# EAGLE schematic MSP-EXP430FR6989 (EAGLE 6.5.0)

## Sheet 1 of 6
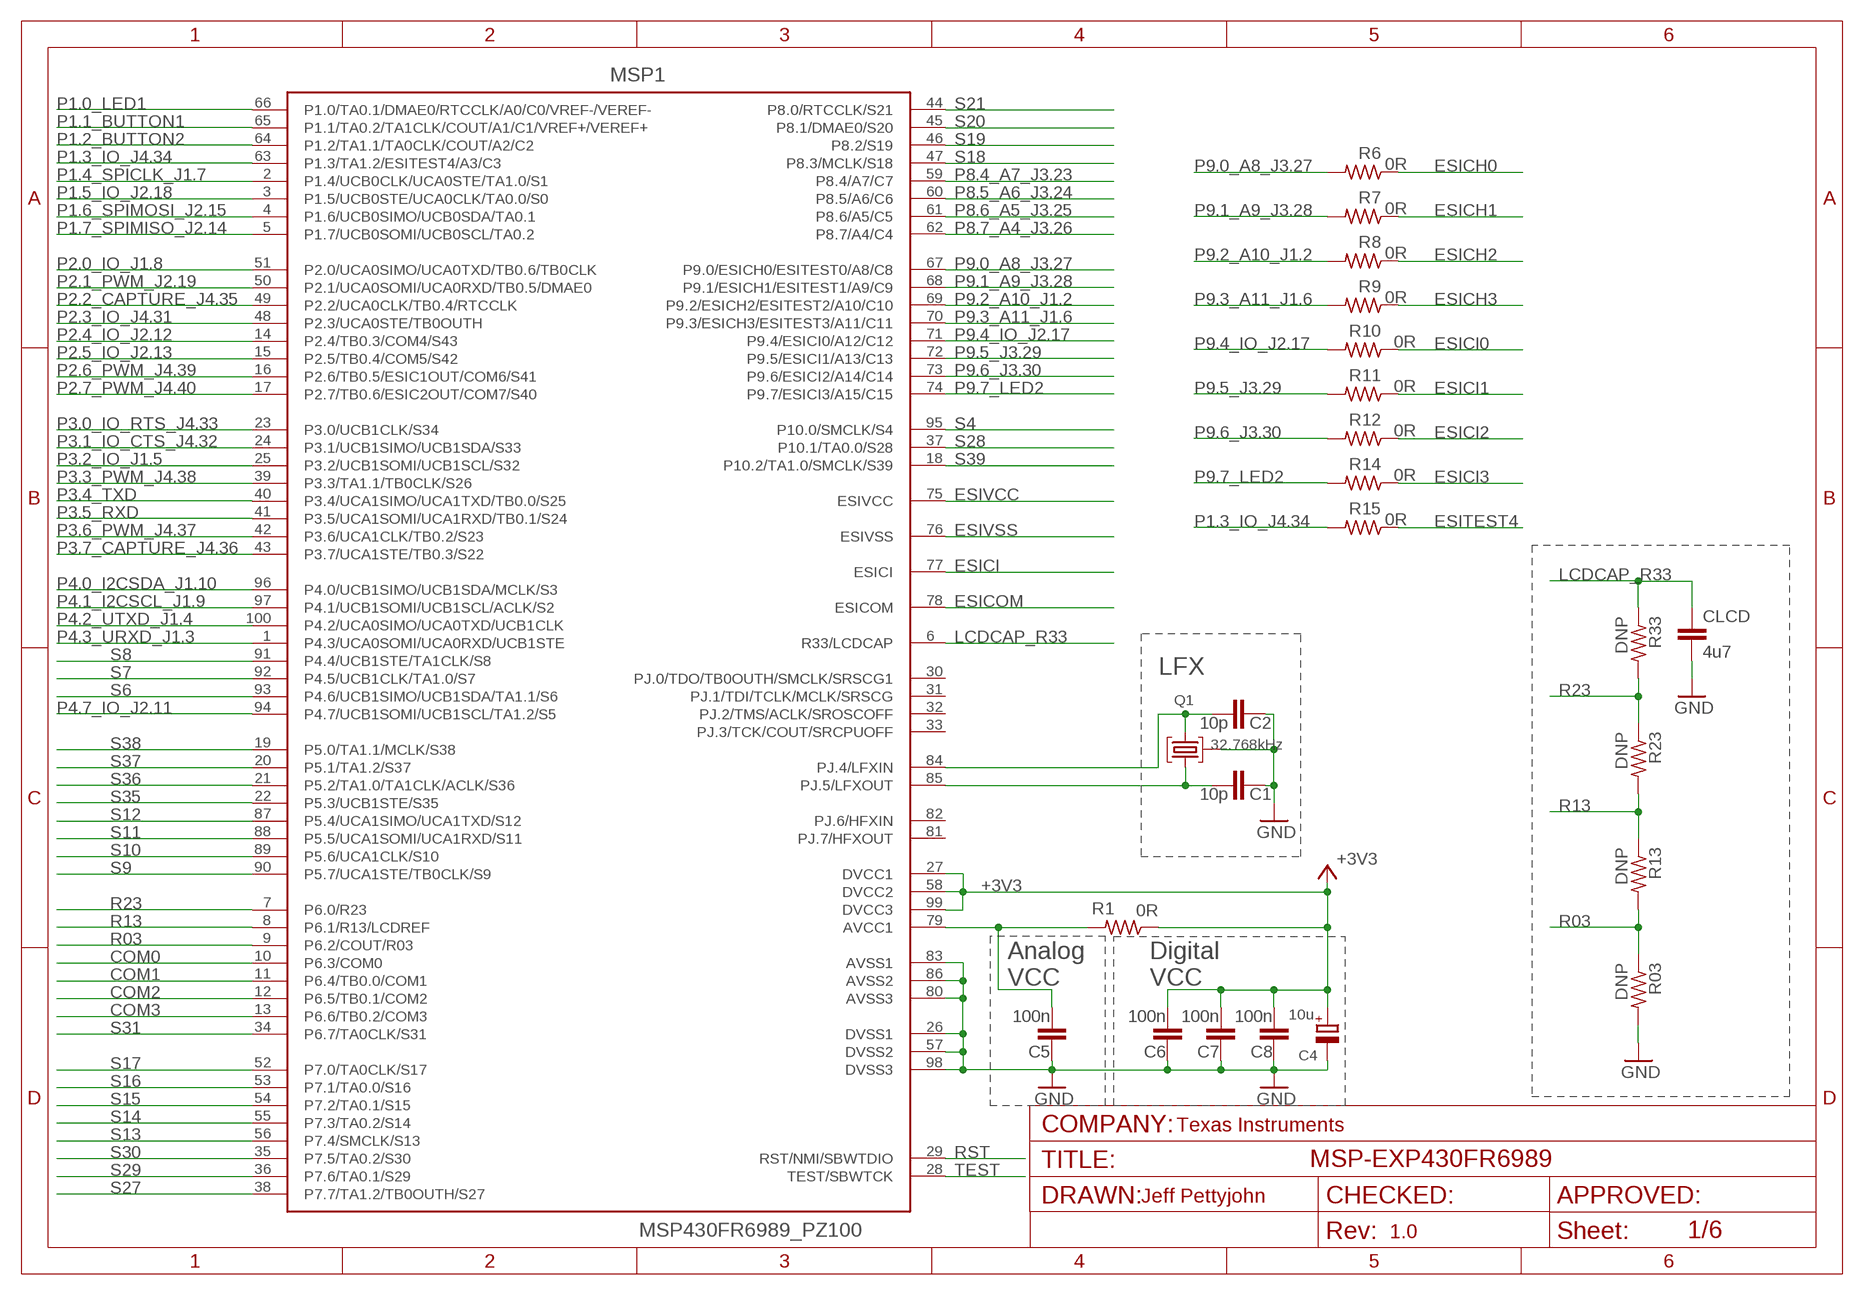
[diagram p0: schematic, sheet 1]

### Parts
C1  10p  C-EUCM0402  [0402]
C2  10p  C-EUCM0402  [0402]
C4  10u  CPOL-EUA/3216-18R  [A/3216-18R]
C5  100n  C-EUCM0402  [0402]
C6  100n  C-EUCM0402  [0402]
C7  100n  C-EUCM0402  [0402]
C8  100n  C-EUCM0402  [0402]
CLCD  4u7  CAPC0603  [0603]
MSP1  MSP430FR6989_PZ100  [PZ100]
Q1  32.768kHz  MS3V-T1R  [MS3V-T1R]
R1  0R  RESR0402  [0402]
R03  DNP  RESR0603  [0603]
R6  0R  RESR0402  [0402]
R7  0R  RESR0402  [0402]
R8  0R  RESR0402  [0402]
R9  0R  RESR0402  [0402]
R10  0R  RESR0402  [0402]
R11  0R  RESR0402  [0402]
R12  0R  RESR0402  [0402]
R13  DNP  RESR0603  [0603]
R14  0R  RESR0402  [0402]
R15  0R  RESR0402  [0402]
R23  DNP  RESR0603  [0603]
R33  DNP  RESR0603  [0603]

### Nets
+3V3: C4.+ C6.1 C7.1 C8.1 MSP1.27(DVCC1) MSP1.58(DVCC2) MSP1.99(DVCC3) R1.1 ; also sheet 2,3,5
COM0: MSP1.10(P6.3/COM0) ; also sheet 2
COM1: MSP1.11(P6.4/TB0.0/COM1) ; also sheet 2
COM2: MSP1.12(P6.5/TB0.1/COM2) ; also sheet 2
COM3: MSP1.13(P6.6/TB0.2/COM3) ; also sheet 2
ESICH0: R6.1 ; also sheet 2
ESICH1: R7.1 ; also sheet 2
ESICH2: R8.1 ; also sheet 2
ESICH3: R9.1 ; also sheet 2
ESICI: MSP1.77(ESICI) ; also sheet 2
ESICI0: R10.1 ; also sheet 2
ESICI1: R11.1 ; also sheet 2
ESICI2: R12.1 ; also sheet 2
ESICI3: R14.1 ; also sheet 2
ESICOM: MSP1.78(ESICOM) ; also sheet 2
ESITEST4: R15.1 ; also sheet 2
ESIVCC: MSP1.75(ESIVCC) ; also sheet 2
ESIVSS: MSP1.76(ESIVSS) ; also sheet 2
GND: C1.2 C2.2 C4.- C5.2 C6.2 C7.2 C8.2 CLCD.2 MSP1.26(DVSS1) MSP1.57(DVSS2) MSP1.80(AVSS3) MSP1.83(AVSS1) MSP1.86(AVSS2) MSP1.98(DVSS3) Q1.P3(GND) R03.2 ; also sheet 2,3,4,5,6
LCDCAP_R33: CLCD.1 MSP1.6(R33/LCDCAP) R33.1
N$3: C5.1 MSP1.79(AVCC1) R1.2
N$14: C1.1 MSP1.85(PJ.5/LFXOUT) Q1.P1
N$17: C2.1 MSP1.84(PJ.4/LFXIN) Q1.P2
P1.0_LED1: MSP1.66(P1.0/TA0.1/DMAE0/RTCCLK/A0/C0/VREF-/VEREF-) ; also sheet 3
P1.1_BUTTON1: MSP1.65(P1.1/TA0.2/TA1CLK/COUT/A1/C1/VREF+/VEREF+) ; also sheet 3
P1.2_BUTTON2: MSP1.64(P1.2/TA1.1/TA0CLK/COUT/A2/C2) ; also sheet 3
P1.3_IO_J4.34: MSP1.63(P1.3/TA1.2/ESITEST4/A3/C3) R15.2 ; also sheet 2
P1.4_SPICLK_J1.7: MSP1.2(P1.4/UCB0CLK/UCA0STE/TA1.0/S1) ; also sheet 2
P1.5_IO_J2.18: MSP1.3(P1.5/UCB0STE/UCA0CLK/TA0.0/S0) ; also sheet 2
P1.6_SPIMOSI_J2.15: MSP1.4(P1.6/UCB0SIMO/UCB0SDA/TA0.1) ; also sheet 2
P1.7_SPIMISO_J2.14: MSP1.5(P1.7/UCB0SOMI/UCB0SCL/TA0.2) ; also sheet 2
P2.0_IO_J1.8: MSP1.51(P2.0/UCA0SIMO/UCA0TXD/TB0.6/TB0CLK) ; also sheet 2
P2.1_PWM_J2.19: MSP1.50(P2.1/UCA0SOMI/UCA0RXD/TB0.5/DMAE0) ; also sheet 2
P2.2_CAPTURE_J4.35: MSP1.49(P2.2/UCA0CLK/TB0.4/RTCCLK) ; also sheet 2
P2.3_IO_J4.31: MSP1.48(P2.3/UCA0STE/TB0OUTH) ; also sheet 2
P2.4_IO_J2.12: MSP1.14(P2.4/TB0.3/COM4/S43) ; also sheet 2
P2.5_IO_J2.13: MSP1.15(P2.5/TB0.4/COM5/S42) ; also sheet 2
P2.6_PWM_J4.39: MSP1.16(P2.6/TB0.5/ESIC1OUT/COM6/S41) ; also sheet 2
P2.7_PWM_J4.40: MSP1.17(P2.7/TB0.6/ESIC2OUT/COM7/S40) ; also sheet 2
P3.0_IO_RTS_J4.33: MSP1.23(P3.0/UCB1CLK/S34) ; also sheet 2,5
P3.1_IO_CTS_J4.32: MSP1.24(P3.1/UCB1SIMO/UCB1SDA/S33) ; also sheet 2,5
P3.2_IO_J1.5: MSP1.25(P3.2/UCB1SOMI/UCB1SCL/S32) ; also sheet 2
P3.3_PWM_J4.38: MSP1.39(P3.3/TA1.1/TB0CLK/S26) ; also sheet 2
P3.4_TXD: MSP1.40(P3.4/UCA1SIMO/UCA1TXD/TB0.0/S25) ; also sheet 5
P3.5_RXD: MSP1.41(P3.5/UCA1SOMI/UCA1RXD/TB0.1/S24) ; also sheet 5
P3.6_PWM_J4.37: MSP1.42(P3.6/UCA1CLK/TB0.2/S23) ; also sheet 2
P3.7_CAPTURE_J4.36: MSP1.43(P3.7/UCA1STE/TB0.3/S22) ; also sheet 2
P4.0_I2CSDA_J1.10: MSP1.96(P4.0/UCB1SIMO/UCB1SDA/MCLK/S3) ; also sheet 2
P4.1_I2CSCL_J1.9: MSP1.97(P4.1/UCB1SOMI/UCB1SCL/ACLK/S2) ; also sheet 2
P4.2_UTXD_J1.4: MSP1.100(P4.2/UCA0SIMO/UCA0TXD/UCB1CLK) ; also sheet 2
P4.3_URXD_J1.3: MSP1.1(P4.3/UCA0SOMI/UCA0RXD/UCB1STE) ; also sheet 2
P4.7_IO_J2.11: MSP1.94(P4.7/UCB1SOMI/UCB1SCL/TA1.2/S5) ; also sheet 2
P8.4_A7_J3.23: MSP1.59(P8.4/A7/C7) ; also sheet 2
P8.5_A6_J3.24: MSP1.60(P8.5/A6/C6) ; also sheet 2
P8.6_A5_J3.25: MSP1.61(P8.6/A5/C5) ; also sheet 2
P8.7_A4_J3.26: MSP1.62(P8.7/A4/C4) ; also sheet 2
P9.0_A8_J3.27: MSP1.67(P9.0/ESICH0/ESITEST0/A8/C8) R6.2 ; also sheet 2
P9.1_A9_J3.28: MSP1.68(P9.1/ESICH1/ESITEST1/A9/C9) R7.2 ; also sheet 2
P9.2_A10_J1.2: MSP1.69(P9.2/ESICH2/ESITEST2/A10/C10) R8.2 ; also sheet 2
P9.3_A11_J1.6: MSP1.70(P9.3/ESICH3/ESITEST3/A11/C11) R9.2 ; also sheet 2
P9.4_IO_J2.17: MSP1.71(P9.4/ESICI0/A12/C12) R10.2 ; also sheet 2
P9.5_J3.29: MSP1.72(P9.5/ESICI1/A13/C13) R11.2 ; also sheet 2
P9.6_J3.30: MSP1.73(P9.6/ESICI2/A14/C14) R12.2 ; also sheet 2
P9.7_LED2: MSP1.74(P9.7/ESICI3/A15/C15) R14.2 ; also sheet 3
R03: MSP1.9(P6.2/COUT/R03) R03.1 R13.2
R13: MSP1.8(P6.1/R13/LCDREF) R13.1 R23.2
R23: MSP1.7(P6.0/R23) R23.1 R33.2
RST: MSP1.29(RST/NMI/SBWTDIO) ; also sheet 2,3,5
S4: MSP1.95(P10.0/SMCLK/S4) ; also sheet 2
S6: MSP1.93(P4.6/UCB1SIMO/UCB1SDA/TA1.1/S6) ; also sheet 2
S7: MSP1.92(P4.5/UCB1CLK/TA1.0/S7) ; also sheet 2
S8: MSP1.91(P4.4/UCB1STE/TA1CLK/S8) ; also sheet 2
S9: MSP1.90(P5.7/UCA1STE/TB0CLK/S9) ; also sheet 2
S10: MSP1.89(P5.6/UCA1CLK/S10) ; also sheet 2
S11: MSP1.88(P5.5/UCA1SOMI/UCA1RXD/S11) ; also sheet 2
S12: MSP1.87(P5.4/UCA1SIMO/UCA1TXD/S12) ; also sheet 2
S13: MSP1.56(P7.4/SMCLK/S13) ; also sheet 2
S14: MSP1.55(P7.3/TA0.2/S14) ; also sheet 2
S15: MSP1.54(P7.2/TA0.1/S15) ; also sheet 2
S16: MSP1.53(P7.1/TA0.0/S16) ; also sheet 2
S17: MSP1.52(P7.0/TA0CLK/S17) ; also sheet 2
S18: MSP1.47(P8.3/MCLK/S18) ; also sheet 2
S19: MSP1.46(P8.2/S19) ; also sheet 2
S20: MSP1.45(P8.1/DMAE0/S20) ; also sheet 2
S21: MSP1.44(P8.0/RTCCLK/S21) ; also sheet 2
S27: MSP1.38(P7.7/TA1.2/TB0OUTH/S27) ; also sheet 2
S28: MSP1.37(P10.1/TA0.0/S28) ; also sheet 2
S29: MSP1.36(P7.6/TA0.1/S29) ; also sheet 2
S30: MSP1.35(P7.5/TA0.2/S30) ; also sheet 2
S31: MSP1.34(P6.7/TA0CLK/S31) ; also sheet 2
S35: MSP1.22(P5.3/UCB1STE/S35) ; also sheet 2
S36: MSP1.21(P5.2/TA1.0/TA1CLK/ACLK/S36) ; also sheet 2
S37: MSP1.20(P5.1/TA1.2/S37) ; also sheet 2
S38: MSP1.19(P5.0/TA1.1/MCLK/S38) ; also sheet 2
S39: MSP1.18(P10.2/TA1.0/SMCLK/S39) ; also sheet 2
TEST: MSP1.28(TEST/SBWTCK) ; also sheet 5
Unconnected: MSP1.30(PJ.0/TDO/TB0OUTH/SMCLK/SRSCG1) MSP1.31(PJ.1/TDI/TCLK/MCLK/SRSCG) MSP1.32(PJ.2/TMS/ACLK/SROSCOFF) MSP1.33(PJ.3/TCK/COUT/SRCPUOFF) MSP1.81(PJ.7/HFXOUT) MSP1.82(PJ.6/HFXIN)

### Notes on the sheet
- LFX
- Analog | Digital
- VCC | VCC
- Texas Instruments
- Jeff Pettyjohn
- 1.0

## Sheet 2 of 6
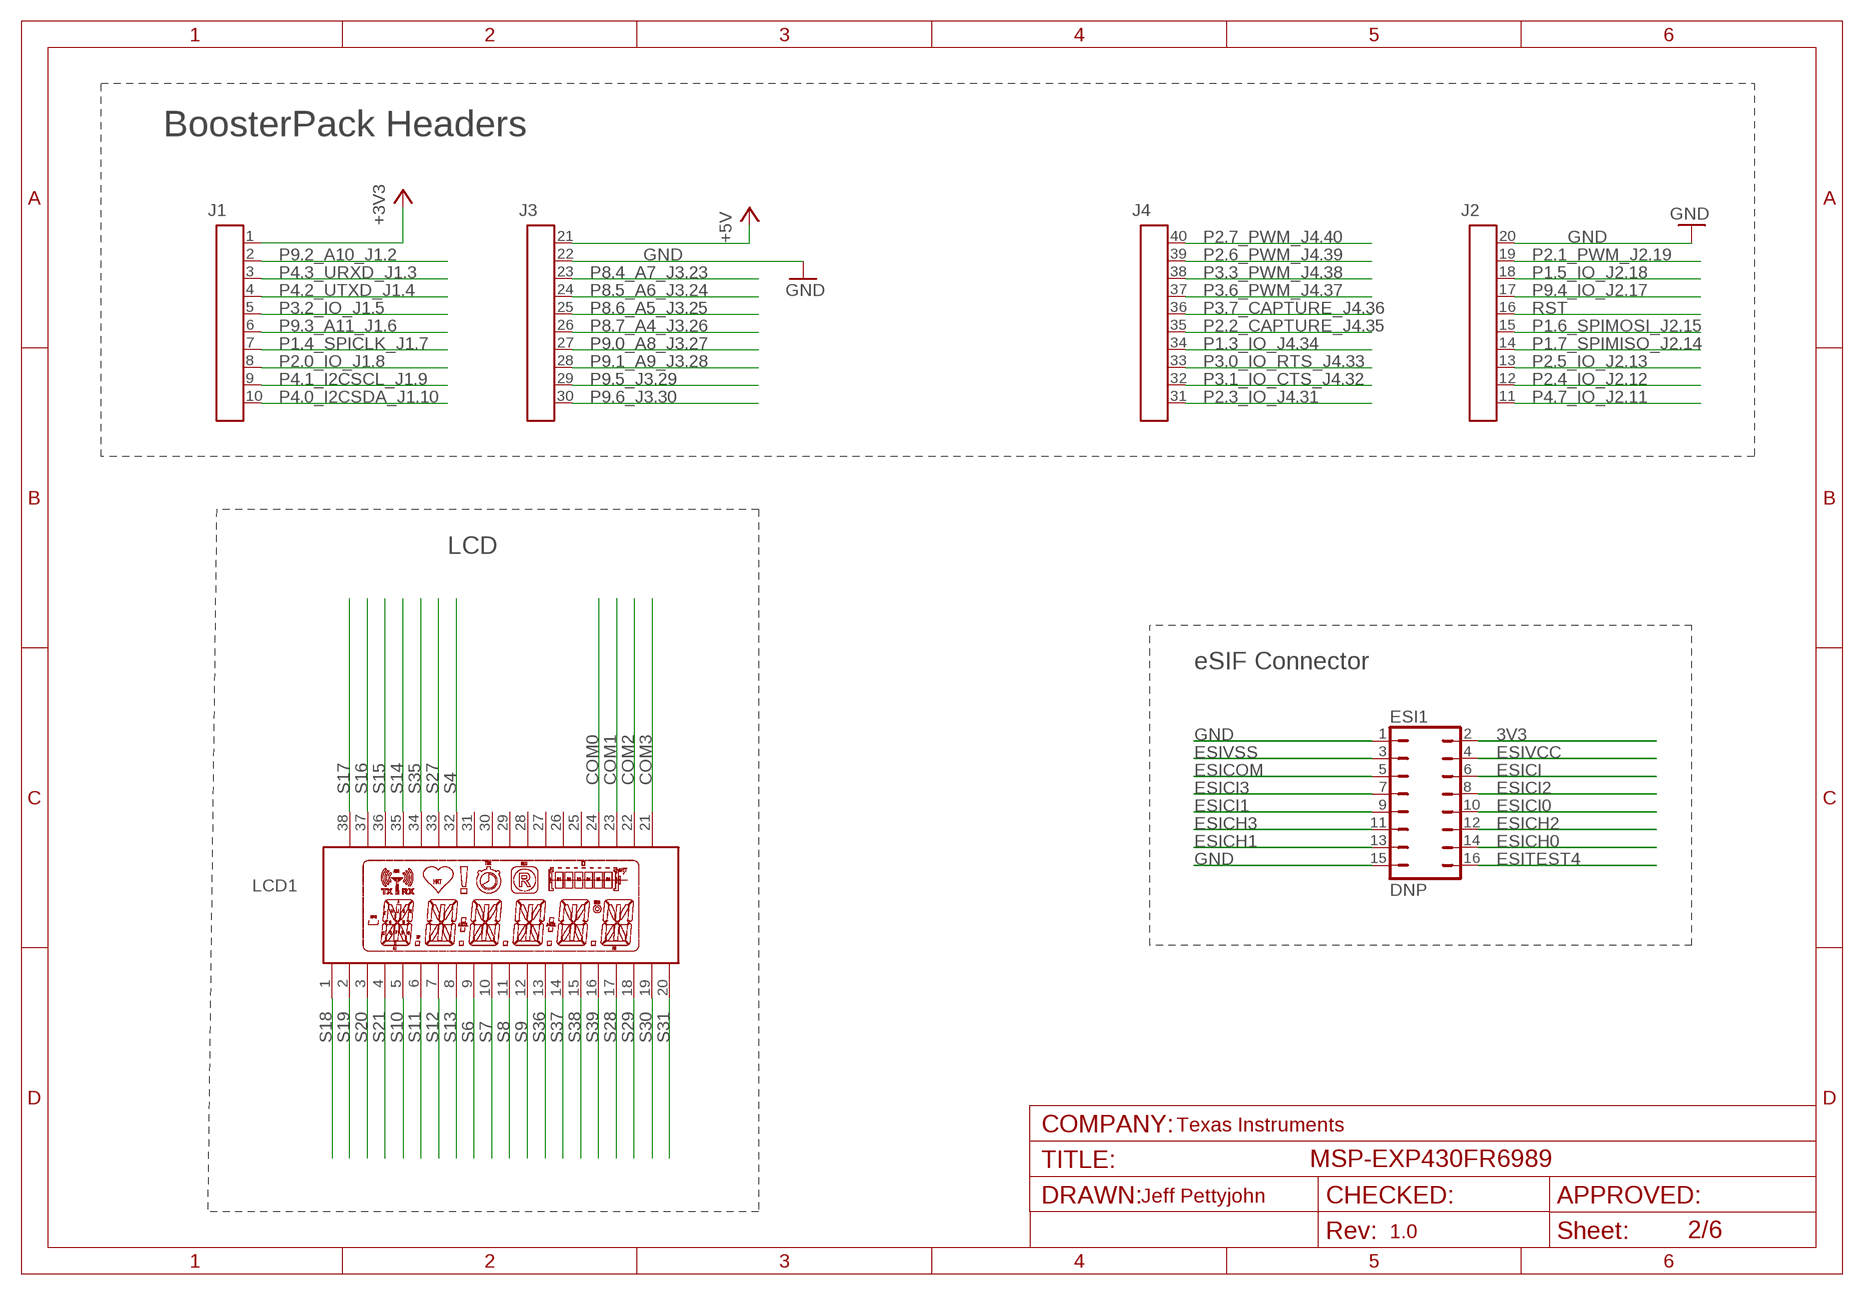
[diagram p1: schematic, sheet 2]

### Parts
ESI1  DNP  JP8Q  [JP8Q]
J1  HEADER1X10  [1X10]
J2  HEADER1X10-J2  [1X10-J2]
J3  HEADER1X10-J3  [1X10-J3]
J4  HEADER1X10-J4  [1X10-J4]
LCD1  FH1138P  [FH1138P]

### Nets
3V3: ESI1.2
+3V3: J1.1 ; also sheet 1,3,5
+5V [Power]: J3.21 ; also sheet 3,5
COM0: LCD1.24 ; also sheet 1
COM1: LCD1.23 ; also sheet 1
COM2: LCD1.22 ; also sheet 1
COM3: LCD1.21 ; also sheet 1
ESICH0: ESI1.14 ; also sheet 1
ESICH1: ESI1.13 ; also sheet 1
ESICH2: ESI1.12 ; also sheet 1
ESICH3: ESI1.11 ; also sheet 1
ESICI: ESI1.6 ; also sheet 1
ESICI0: ESI1.10 ; also sheet 1
ESICI1: ESI1.9 ; also sheet 1
ESICI2: ESI1.8 ; also sheet 1
ESICI3: ESI1.7 ; also sheet 1
ESICOM: ESI1.5 ; also sheet 1
ESITEST4: ESI1.16 ; also sheet 1
ESIVCC: ESI1.4 ; also sheet 1
ESIVSS: ESI1.3 ; also sheet 1
GND: ESI1.1 ESI1.15 J2.20 J3.22 ; also sheet 1,3,4,5,6
P1.3_IO_J4.34: J4.34 ; also sheet 1
P1.4_SPICLK_J1.7: J1.7 ; also sheet 1
P1.5_IO_J2.18: J2.18 ; also sheet 1
P1.6_SPIMOSI_J2.15: J2.15 ; also sheet 1
P1.7_SPIMISO_J2.14: J2.14 ; also sheet 1
P2.0_IO_J1.8: J1.8 ; also sheet 1
P2.1_PWM_J2.19: J2.19 ; also sheet 1
P2.2_CAPTURE_J4.35: J4.35 ; also sheet 1
P2.3_IO_J4.31: J4.31 ; also sheet 1
P2.4_IO_J2.12: J2.12 ; also sheet 1
P2.5_IO_J2.13: J2.13 ; also sheet 1
P2.6_PWM_J4.39: J4.39 ; also sheet 1
P2.7_PWM_J4.40: J4.40 ; also sheet 1
P3.0_IO_RTS_J4.33: J4.33 ; also sheet 1,5
P3.1_IO_CTS_J4.32: J4.32 ; also sheet 1,5
P3.2_IO_J1.5: J1.5 ; also sheet 1
P3.3_PWM_J4.38: J4.38 ; also sheet 1
P3.6_PWM_J4.37: J4.37 ; also sheet 1
P3.7_CAPTURE_J4.36: J4.36 ; also sheet 1
P4.0_I2CSDA_J1.10: J1.10 ; also sheet 1
P4.1_I2CSCL_J1.9: J1.9 ; also sheet 1
P4.2_UTXD_J1.4: J1.4 ; also sheet 1
P4.3_URXD_J1.3: J1.3 ; also sheet 1
P4.7_IO_J2.11: J2.11 ; also sheet 1
P8.4_A7_J3.23: J3.23 ; also sheet 1
P8.5_A6_J3.24: J3.24 ; also sheet 1
P8.6_A5_J3.25: J3.25 ; also sheet 1
P8.7_A4_J3.26: J3.26 ; also sheet 1
P9.0_A8_J3.27: J3.27 ; also sheet 1
P9.1_A9_J3.28: J3.28 ; also sheet 1
P9.2_A10_J1.2: J1.2 ; also sheet 1
P9.3_A11_J1.6: J1.6 ; also sheet 1
P9.4_IO_J2.17: J2.17 ; also sheet 1
P9.5_J3.29: J3.29 ; also sheet 1
P9.6_J3.30: J3.30 ; also sheet 1
RST: J2.16 ; also sheet 1,3,5
S4: LCD1.32 ; also sheet 1
S6: LCD1.9 ; also sheet 1
S7: LCD1.10 ; also sheet 1
S8: LCD1.11 ; also sheet 1
S9: LCD1.12 ; also sheet 1
S10: LCD1.5 ; also sheet 1
S11: LCD1.6 ; also sheet 1
S12: LCD1.7 ; also sheet 1
S13: LCD1.8 ; also sheet 1
S14: LCD1.35 ; also sheet 1
S15: LCD1.36 ; also sheet 1
S16: LCD1.37 ; also sheet 1
S17: LCD1.38 ; also sheet 1
S18: LCD1.1 ; also sheet 1
S19: LCD1.2 ; also sheet 1
S20: LCD1.3 ; also sheet 1
S21: LCD1.4 ; also sheet 1
S27: LCD1.33 ; also sheet 1
S28: LCD1.17 ; also sheet 1
S29: LCD1.18 ; also sheet 1
S30: LCD1.19 ; also sheet 1
S31: LCD1.20 ; also sheet 1
S35: LCD1.34 ; also sheet 1
S36: LCD1.13 ; also sheet 1
S37: LCD1.14 ; also sheet 1
S38: LCD1.15 ; also sheet 1
S39: LCD1.16 ; also sheet 1
Unconnected: LCD1.25 LCD1.26 LCD1.27 LCD1.28 LCD1.29 LCD1.30 LCD1.31

### Notes on the sheet
- BoosterPack Headers
- LCD
- eSIF Connector
- Texas Instruments
- Jeff Pettyjohn
- 1.0

## Sheet 3 of 6
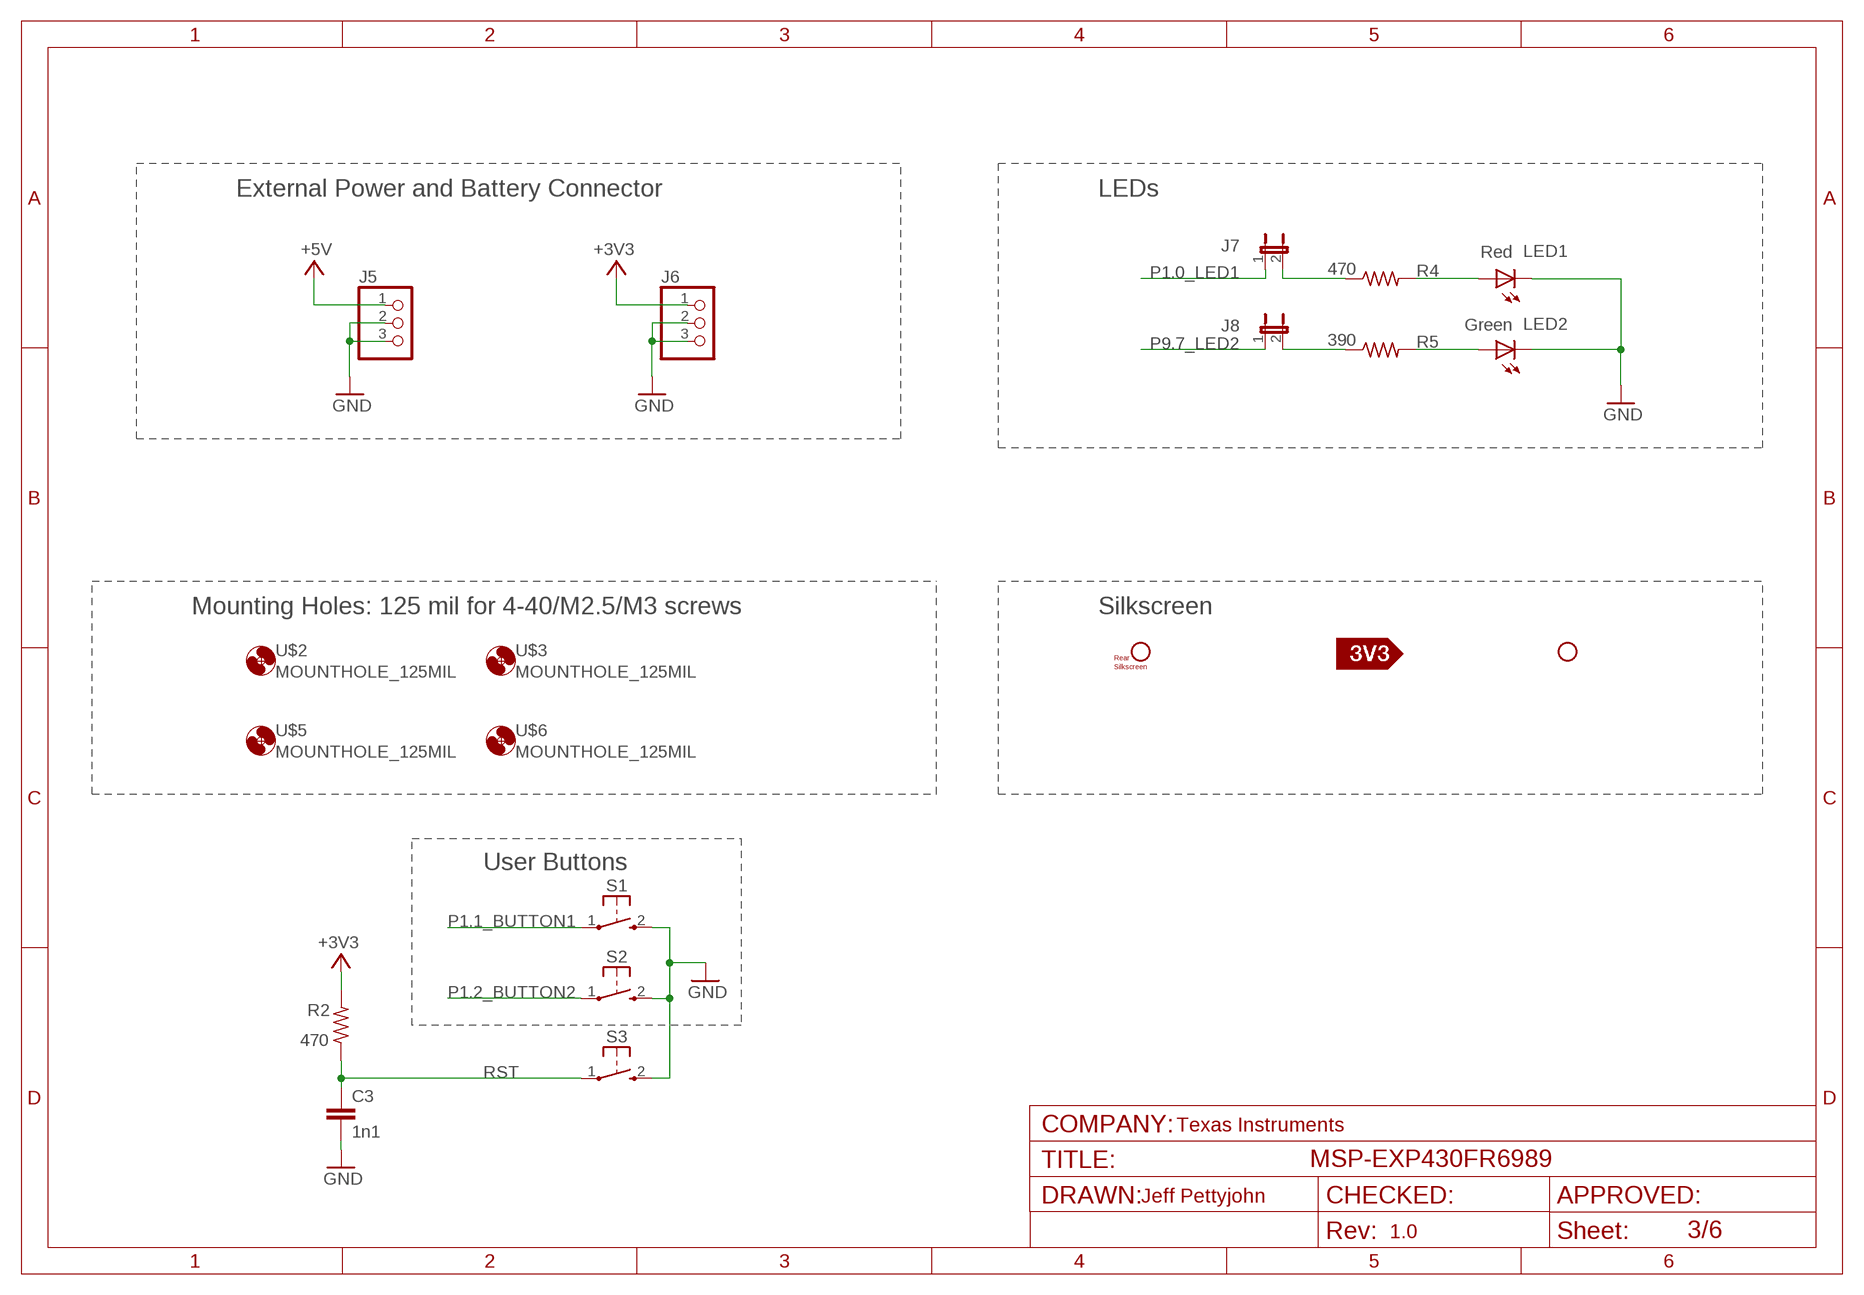
[diagram p2: schematic, sheet 3]

### Parts
C3  1n1  C-EUCM0402  [0402]
J5  PINHEADER1X3  [PINHEADER1X3]
J6  PINHEADER1X3  [PINHEADER1X3]
J7  JUMPER_2.51MM  [JUMPER-2.54]
J8  JUMPER_2.51MM  [JUMPER-2.54]
LED1  Red  CHIP-LED  [LED0805]
LED2  Green  CHIP-LED  [LED0805]
R2  470  RESR0402  [0402]
R4  470  RESR0402  [0402]
R5  390  RESR0402  [0402]
S1  PB  [PBTH]
S2  PB  [PBTH]
S3  PB  [PBTH]
U$1  FR6989_REARSILK_REV0_1  [FR6989_REARSILK_REV0_1]
U$2  MOUNTHOLE_125MIL  [MOUNTHOLE_125MIL]
U$3  MOUNTHOLE_125MIL  [MOUNTHOLE_125MIL]
U$5  MOUNTHOLE_125MIL  [MOUNTHOLE_125MIL]
U$6  MOUNTHOLE_125MIL  [MOUNTHOLE_125MIL]
U$7  SILK_3V3_TAG  [SILK_3V3_TAG]
U$8  ESIF  [ESIF]

### Nets
+3V3: J6.1 R2.2 ; also sheet 1,2,5
+5V [Power]: J5.1 ; also sheet 2,5
GND: C3.2 J5.2 J5.3 J6.2 J6.3 LED1.C LED2.C S1.2(S) S2.2(S) S3.2(S) ; also sheet 1,2,4,5,6
N$4: J8.2 R5.1
N$6: J7.2 R4.1
N$7: LED1.A R4.2
N$8: LED2.A R5.2
P1.0_LED1: J7.1 ; also sheet 1
P1.1_BUTTON1: S1.1(P) ; also sheet 1
P1.2_BUTTON2: S2.1(P) ; also sheet 1
P9.7_LED2: J8.1 ; also sheet 1
RST: C3.1 R2.1 S3.1(P) ; also sheet 1,2,5

### Notes on the sheet
- External Power and Battery Connector | LEDs
- Mounting Holes: 125 mil for 4-40/M2.5/M3 screws | Silkscreen
- User Buttons
- Texas Instruments
- Jeff Pettyjohn
- 1.0

## Sheet 4 of 6
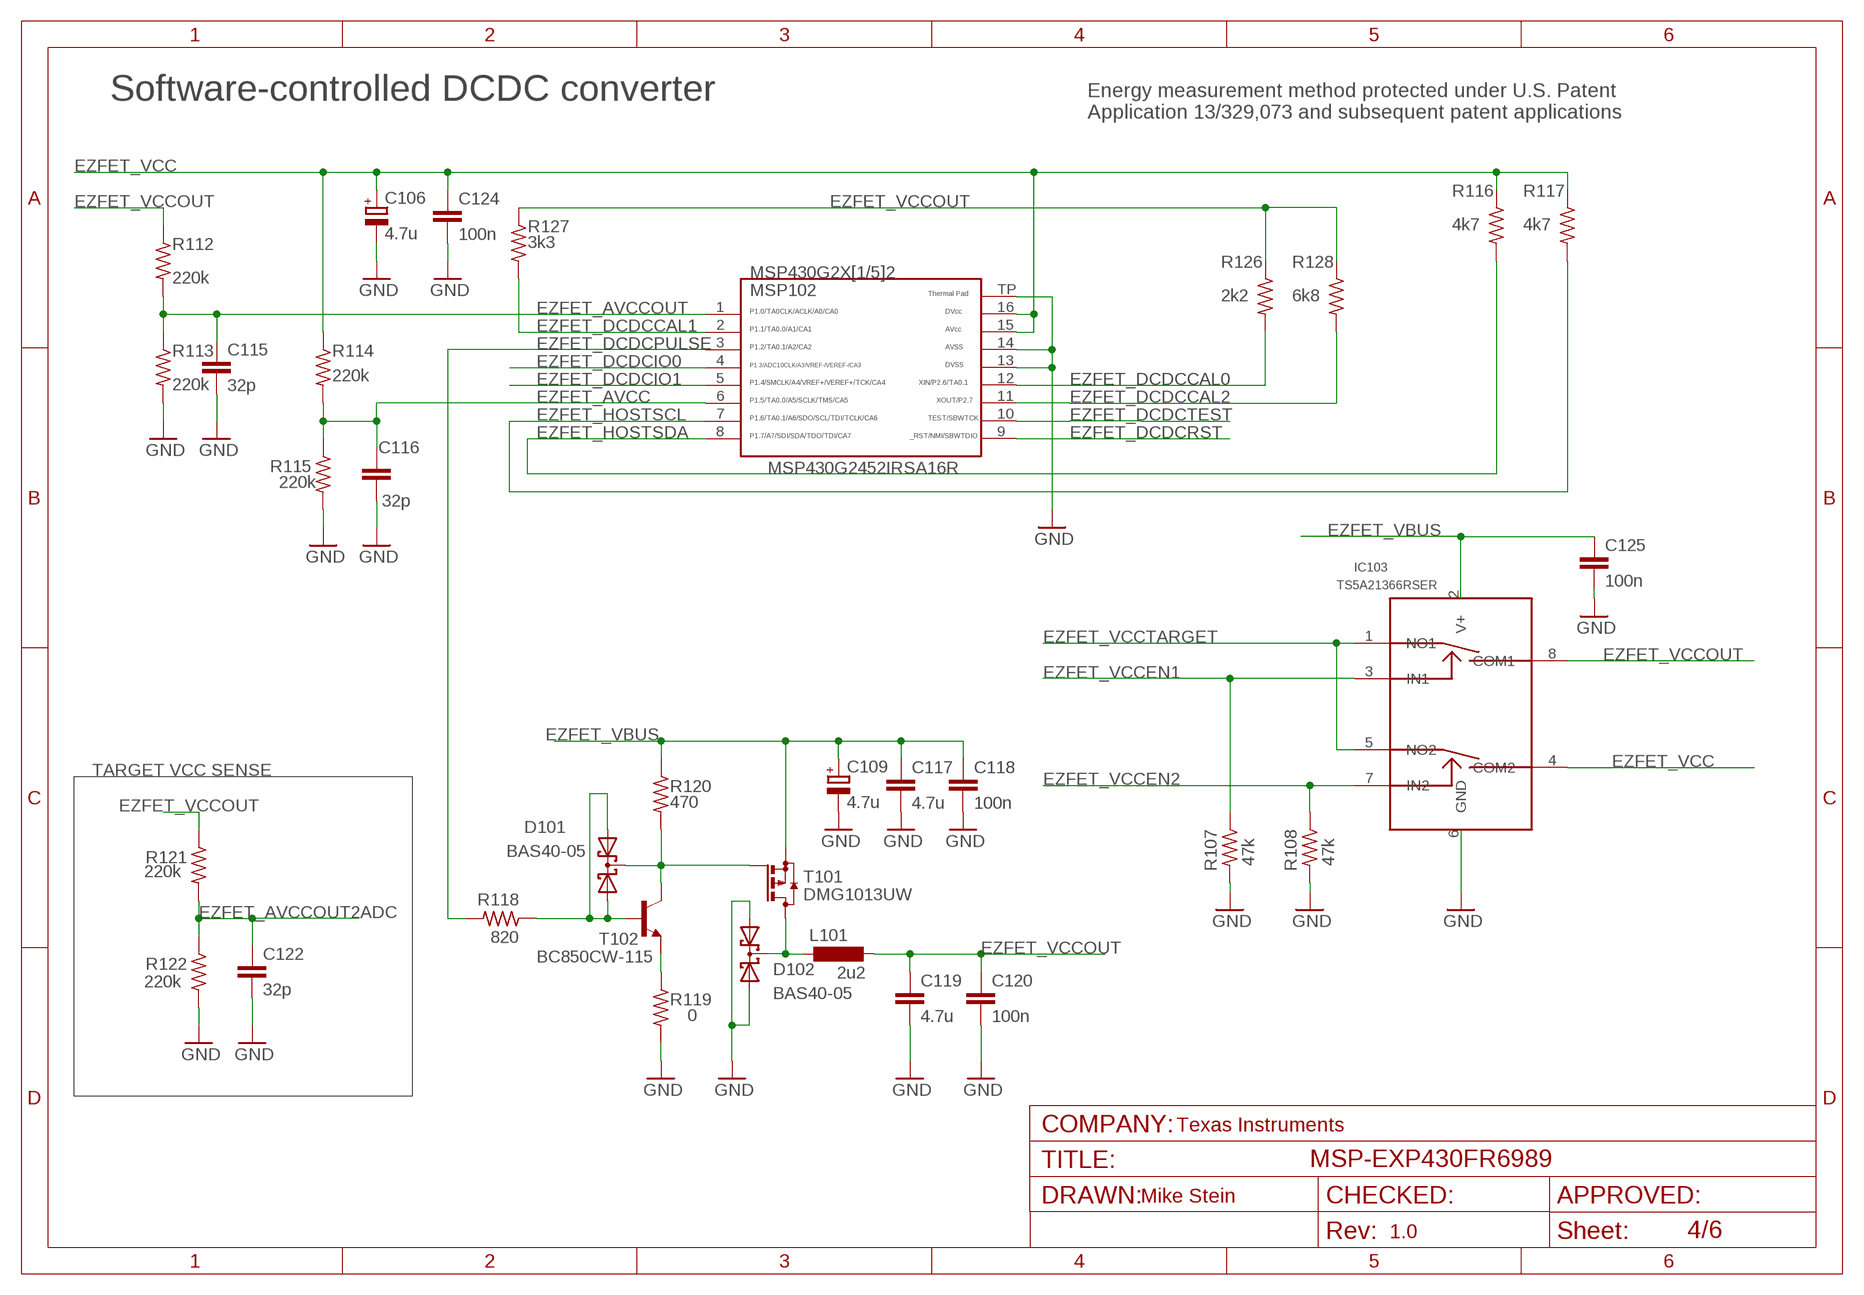
[diagram p3: schematic, sheet 4]

### Parts
C106  4.7u  CPOL-EUA/3216-18R  [A/3216-18R]
C109  4.7u  CPOL-EUA/3216-18R  [A/3216-18R]
C115  32p  C-EUCM0402  [0402]
C116  32p  C-EUCM0402  [0402]
C117  4.7u  C-EUC0603  [C0603]
C118  100n  C-EUCM0402  [0402]
C119  4.7u  C-EUC0603  [C0603]
C120  100n  C-EUCM0402  [0402]
C122  32p  C-EUCM0402  [0402]
C124  100n  C-EUCM0402  [0402]
C125  100n  C-EUCM0402  [0402]
D101  BAS40-05  BAS40-05W  [SOT323]
D102  BAS40-05  BAS40-05W  [SOT323]
IC103  TS5A21366RSER  [UQFN_RSE]
L101  2u2  L-EUL3216C  [L3216C]
MSP102  MSP430G2452IRSA16R  G2X[1/5]2---RSA16  [RSA16]
R107  47k  RESR0402  [0402]
R108  47k  RESR0402  [0402]
R112  220k  RESR0402  [0402]
R113  220k  RESR0402  [0402]
R114  220k  RESR0402  [0402]
R115  220k  RESR0402  [0402]
R116  4k7  RESR0402  [0402]
R117  4k7  RESR0402  [0402]
R118  820  RESR0402  [0402]
R119  0  RESR0402  [0402]
R120  470  RESR0402  [0402]
R121  220k  RESR0402  [0402]
R122  220k  RESR0402  [0402]
R126  2k2  RESR0402  [0402]
R127  3k3  RESR0402  [0402]
R128  6k8  RESR0402  [0402]
T101  DMG1013UW  [SOT323]
T102  BC850CW-115  [SOT323]

### Nets
EZFET_AVCC: C116.2 MSP102.6 R114.2 R115.1
EZFET_AVCCOUT: C115.2 MSP102.1 R112.2 R113.1
EZFET_AVCCOUT2ADC: C122.2 R121.2 R122.1 ; also sheet 5
EZFET_DCDCCAL0: MSP102.12 R126.2
EZFET_DCDCCAL1: MSP102.2 R127.2
EZFET_DCDCCAL2: MSP102.11 R128.2
EZFET_DCDCIO0: MSP102.4 ; also sheet 5
EZFET_DCDCIO1: MSP102.5 ; also sheet 5
EZFET_DCDCPULSE: MSP102.3 R118.2 ; also sheet 5
EZFET_DCDCRST: MSP102.9 ; also sheet 5,6
EZFET_DCDCTEST: MSP102.10 ; also sheet 5,6
EZFET_HOSTSCL: MSP102.7 R117.2 ; also sheet 5
EZFET_HOSTSDA: MSP102.8 R116.2 ; also sheet 5
EZFET_VBUS: C109.+ C117.1 C118.1 C125.1 IC103.2(V+) R120.1 T101.2(S) ; also sheet 5,6
EZFET_VCC: C106.+ C124.1 IC103.4(COM2) MSP102.15 MSP102.16 R114.1 R116.1 R117.1 ; also sheet 5,6
EZFET_VCCEN1: IC103.3(IN1) R107.1 ; also sheet 5
EZFET_VCCEN2: IC103.7(IN2) R108.1 ; also sheet 5
EZFET_VCCOUT: C119.1 C120.1 IC103.8(COM1) L101.2 R112.1 R121.1 R126.1 R127.1 R128.1
EZFET_VCCTARGET: IC103.1(NO1) IC103.5(NO2) ; also sheet 5
GND: C106.- C109.- C115.1 C116.1 C117.2 C118.2 C119.2 C120.2 C122.1 C124.2 C125.2 D102.1(A1) D102.2(A2) IC103.6(GND) MSP102.13 MSP102.14 MSP102.TP R107.2 R108.2 R113.2 R115.2 R119.2 R122.2 ; also sheet 1,2,3,5,6
N$12: R119.1 T102.2(E)
N$13: D101.1(A1) D101.2(A2) R118.1 T102.1(B)
N$15: D102.3(C) L101.1 T101.3(D)
N$16: D101.3(C) R120.2 T101.1(G) T102.3(C)

### Notes on the sheet
- Software-controlled DCDC converter
- Energy measurement method protected under U.S. Patent 
  Application 13/329,073 and subsequent patent applications
- MSP430G2452IRSA16R
- TARGET VCC SENSE
- Texas Instruments
- Mike Stein
- 1.0

## Sheet 5 of 6
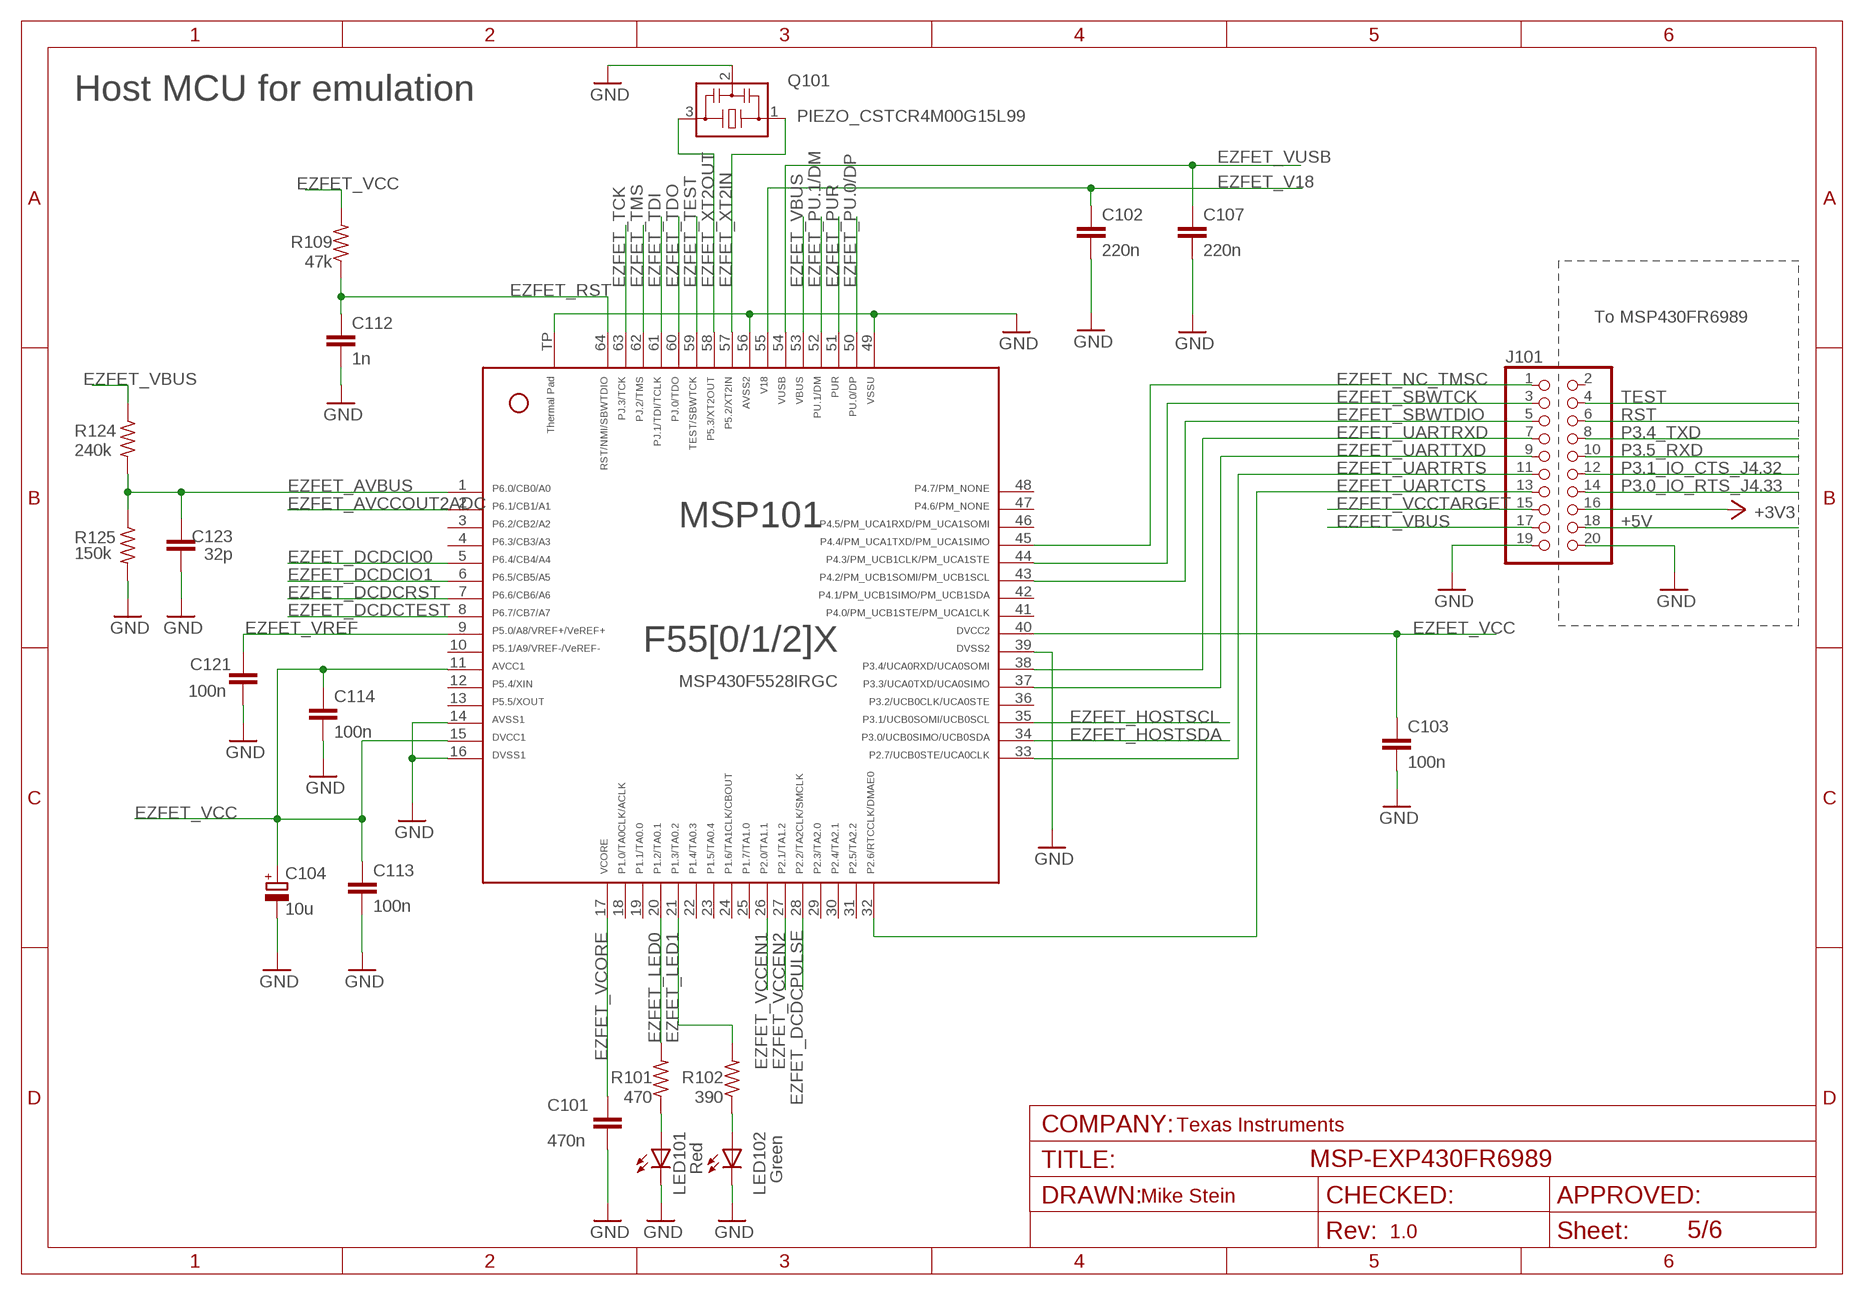
[diagram p4: schematic, sheet 5]

### Parts
C101  470n  C-EUCM0402  [0402]
C102  220n  C-EUCM0402  [0402]
C103  100n  C-EUCM0402  [0402]
C104  10u  CPOL-EUA/3216-18R  [A/3216-18R]
C107  220n  C-EUCM0402  [0402]
C112  1n  C-EUCM0402  [0402]
C113  100n  C-EUCM0402  [0402]
C114  100n  C-EUCM0402  [0402]
C121  100n  C-EUCM0402  [0402]
C123  32p  C-EUCM0402  [0402]
J101  PINHD-2X10  [2X10]
LED101  Red  CHIP-LED  [LED0805]
LED102  Green  CHIP-LED  [LED0805]
MSP101  MSP430F5528IRGC  F55[0/1/2]X---RGC64  [RGC64]
Q101  PIEZO_CSTCR4M00G15L99  CSTCR4M  [CSTCR4M]
R101  470  RESR0402  [0402]
R102  390  RESR0402  [0402]
R109  47k  RESR0402  [0402]
R124  240k  RESR0402  [0402]
R125  150k  RESR0402  [0402]

### Nets
+3V3: J101.16 ; also sheet 1,2,3
+5V [Power]: J101.18 ; also sheet 2,3
EZFET_AVBUS: C123.2 MSP101.1 R124.2 R125.1
EZFET_AVCCOUT2ADC: MSP101.2 ; also sheet 4
EZFET_DCDCIO0: MSP101.5 ; also sheet 4
EZFET_DCDCIO1: MSP101.6 ; also sheet 4
EZFET_DCDCPULSE: MSP101.28 ; also sheet 4
EZFET_DCDCRST: MSP101.7 ; also sheet 4,6
EZFET_DCDCTEST: MSP101.8 ; also sheet 4,6
EZFET_HOSTSCL: MSP101.35 ; also sheet 4
EZFET_HOSTSDA: MSP101.34 ; also sheet 4
EZFET_LED0: MSP101.20 R101.2
EZFET_LED1: MSP101.21 R102.2
EZFET_NC_TMSC: J101.1 MSP101.45
EZFET_PU.0/DP: MSP101.50 ; also sheet 6
EZFET_PU.1/DM: MSP101.52 ; also sheet 6
EZFET_PUR: MSP101.51 ; also sheet 6
EZFET_RST: C112.1 MSP101.64 R109.1 ; also sheet 6
EZFET_SBWTCK: J101.3 MSP101.44
EZFET_SBWTDIO: J101.5 MSP101.43
EZFET_TCK: MSP101.63 ; also sheet 6
EZFET_TDI: MSP101.61 ; also sheet 6
EZFET_TDO: MSP101.60 ; also sheet 6
EZFET_TEST: MSP101.59 ; also sheet 6
EZFET_TMS: MSP101.62 ; also sheet 6
EZFET_UARTCTS: J101.13 MSP101.32
EZFET_UARTRTS: J101.11 MSP101.33
EZFET_UARTRXD: J101.7 MSP101.38
EZFET_UARTTXD: J101.9 MSP101.37
EZFET_V18: C102.1 MSP101.55
EZFET_VBUS: J101.17 MSP101.53 R124.1 ; also sheet 4,6
EZFET_VCC: C103.1 C104.+ C113.1 C114.1 MSP101.11 MSP101.15 MSP101.40 R109.2 ; also sheet 4,6
EZFET_VCCEN1: MSP101.26 ; also sheet 4
EZFET_VCCEN2: MSP101.27 ; also sheet 4
EZFET_VCCTARGET: J101.15 ; also sheet 4
EZFET_VCORE: C101.1 MSP101.17
EZFET_VREF: C121.1 MSP101.9
EZFET_VUSB: C107.1 MSP101.54
EZFET_XT2IN: MSP101.57 Q101.1
EZFET_XT2OUT: MSP101.58 Q101.3
GND: C101.2 C102.2 C103.2 C104.- C107.2 C112.2 C113.2 C114.2 C121.2 C123.1 J101.19 J101.20 LED101.C LED102.C MSP101.14 MSP101.16 MSP101.39 MSP101.49 MSP101.56 MSP101.TP Q101.2 R125.2 ; also sheet 1,2,3,4,6
N$1: LED101.A R101.1
N$2: LED102.A R102.1
P3.0_IO_RTS_J4.33: J101.14 ; also sheet 1,2
P3.1_IO_CTS_J4.32: J101.12 ; also sheet 1,2
P3.4_TXD: J101.8 ; also sheet 1
P3.5_RXD: J101.10 ; also sheet 1
RST: J101.6 ; also sheet 1,2,3
TEST: J101.4 ; also sheet 1
Unconnected: J101.2 MSP101.3 MSP101.4 MSP101.10 MSP101.12 MSP101.13 MSP101.18 MSP101.19 MSP101.22 MSP101.23 MSP101.24 MSP101.25 MSP101.29 MSP101.30 MSP101.31 MSP101.36 MSP101.41 MSP101.42 MSP101.46 MSP101.47 MSP101.48

### Notes on the sheet
- Host MCU for emulation
- To MSP430FR6989
- MSP430F5528IRGC
- Texas Instruments
- Mike Stein
- 1.0

## Sheet 6 of 6
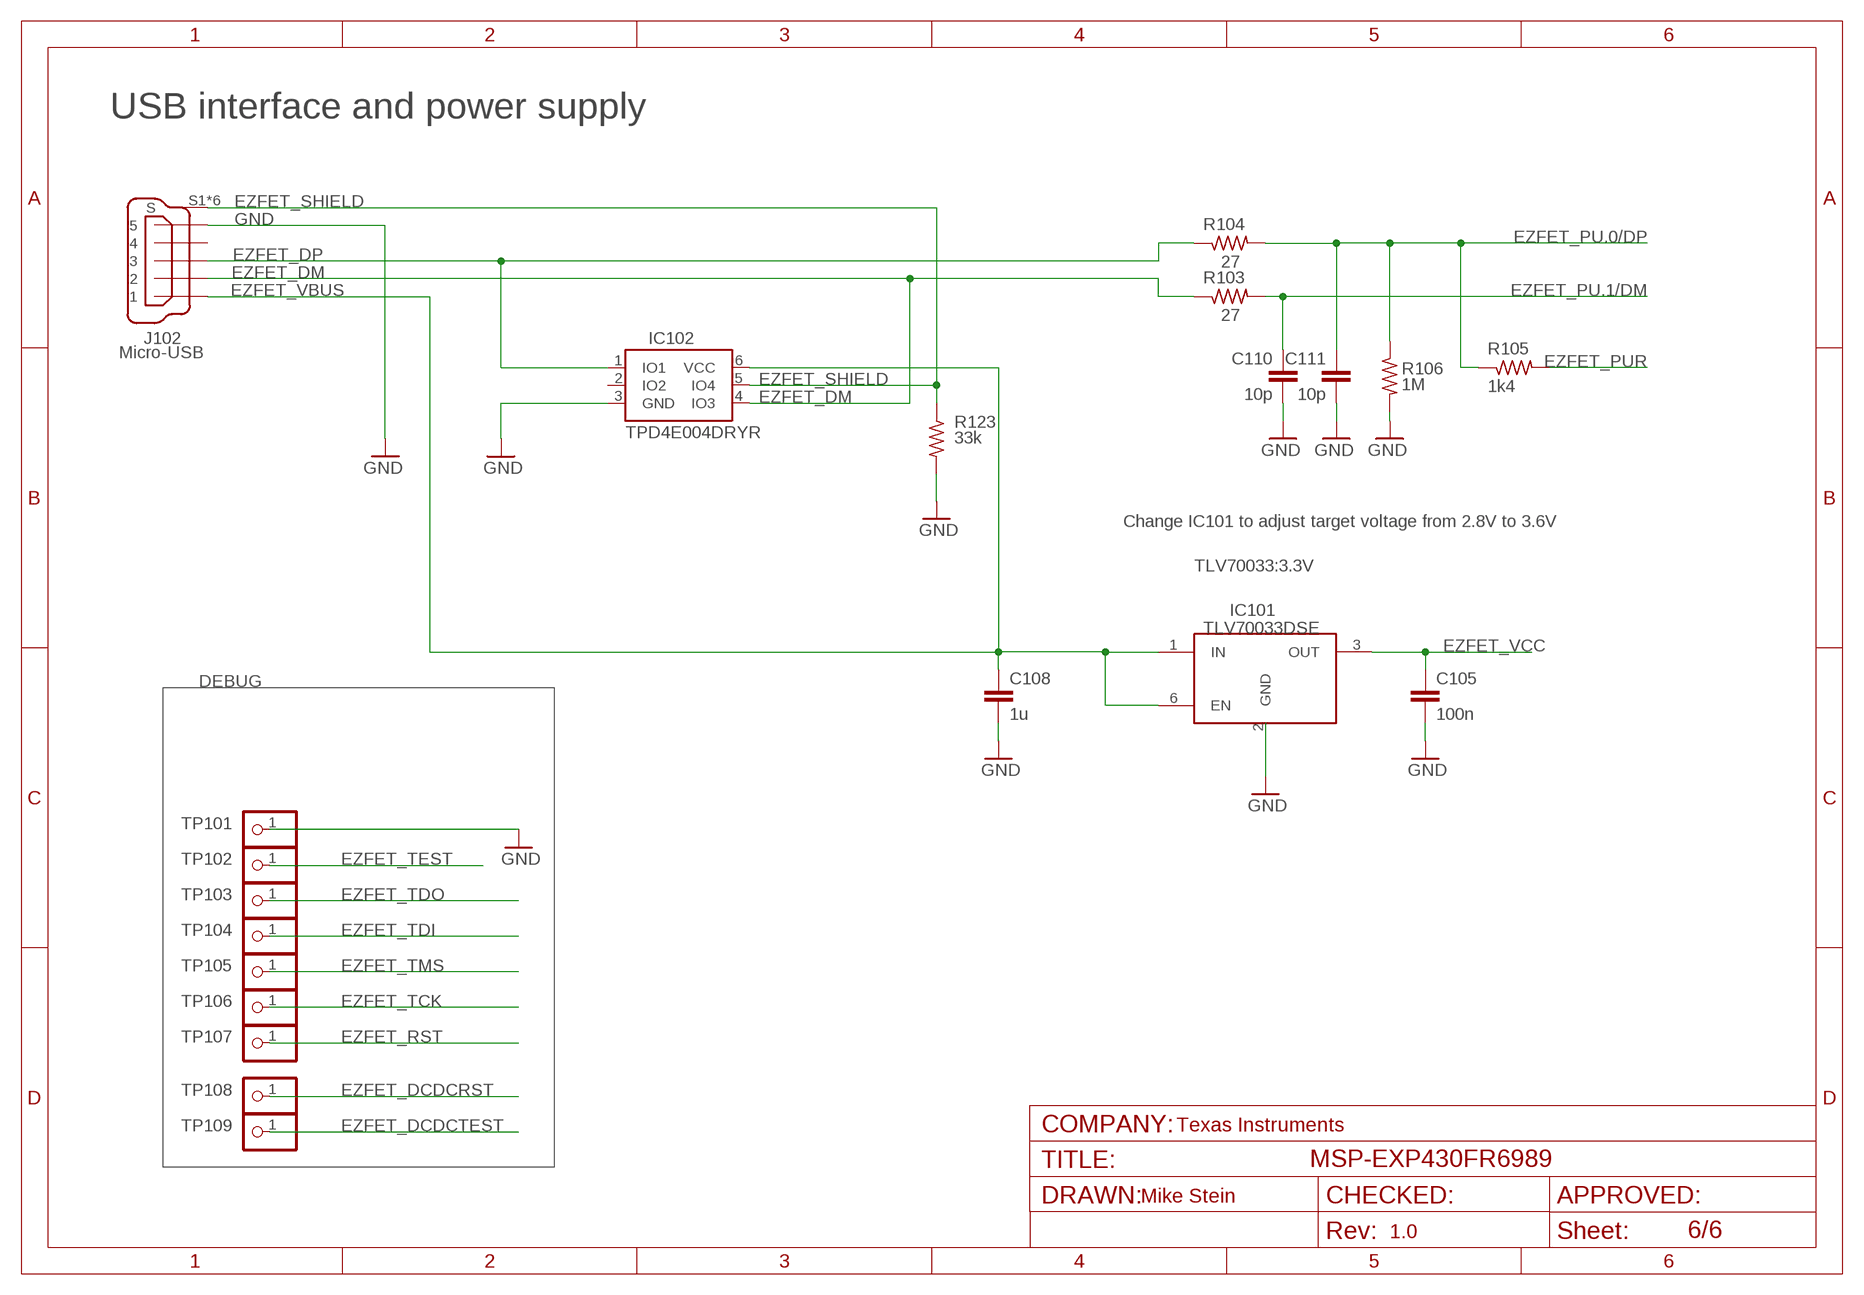
[diagram p5: schematic, sheet 6]

### Parts
C105  100n  C-EUCM0402  [0402]
C108  1u  C-EUC0603  [C0603]
C110  10p  C-EUCM0402  [0402]
C111  10p  C-EUCM0402  [0402]
IC101  TLV70033DSE  [WSON_DSE]
IC102  TPD4E004DRYR  TPD4E004  [SON(DRY)6]
J102  Micro-USB  EZFET_MINI-USB-  [EZFET_UX62M-B-5P]
R103  27  RESR0402  [0402]
R104  27  RESR0402  [0402]
R105  1k4  RESR0402  [0402]
R106  1M  RESR0402  [0402]
R123  33k  RESR0402  [0402]
TP101  TEST_PIN2  PINHD-1X1  [1X01]
TP102  TEST_PIN2  PINHD-1X1  [1X01]
TP103  TEST_PIN2  PINHD-1X1  [1X01]
TP104  TEST_PIN2  PINHD-1X1  [1X01]
TP105  TEST_PIN2  PINHD-1X1  [1X01]
TP106  TEST_PIN2  PINHD-1X1  [1X01]
TP107  TEST_PIN2  PINHD-1X1  [1X01]
TP108  TEST_PIN2  PINHD-1X1  [1X01]
TP109  TEST_PIN2  PINHD-1X1  [1X01]

### Nets
EZFET_DCDCRST: TP108.1 ; also sheet 4,5
EZFET_DCDCTEST: TP109.1 ; also sheet 4,5
EZFET_DM: IC102.4(IO3) J102.2 R103.1
EZFET_DP: IC102.1(IO1) J102.3 R104.1
EZFET_PU.0/DP: C111.1 R104.2 R105.1 R106.1 ; also sheet 5
EZFET_PU.1/DM: C110.1 R103.2 ; also sheet 5
EZFET_PUR: R105.2 ; also sheet 5
EZFET_RST: TP107.1 ; also sheet 5
EZFET_SHIELD: IC102.5(IO4) J102.S1(S) J102.S2(S) J102.S3(S) J102.S4(S) J102.S5(S) J102.S6(S) R123.1
EZFET_TCK: TP106.1 ; also sheet 5
EZFET_TDI: TP104.1 ; also sheet 5
EZFET_TDO: TP103.1 ; also sheet 5
EZFET_TEST: TP102.1 ; also sheet 5
EZFET_TMS: TP105.1 ; also sheet 5
EZFET_VBUS: C108.1 IC101.1(IN) IC101.6(EN) IC102.6(VCC) J102.1 ; also sheet 4,5
EZFET_VCC: C105.1 IC101.3(OUT) ; also sheet 4,5
GND: C105.2 C108.2 C110.2 C111.2 IC101.2(GND) IC102.3(GND) J102.5 R106.2 R123.2 TP101.1 ; also sheet 1,2,3,4,5
Unconnected: IC102.2(IO2) J102.4

### Notes on the sheet
- USB interface and power supply
- Change IC101 to adjust target voltage from 2.8V to 3.6V
- TLV70033:3.3V
- TLV70033DSE
- DEBUG
- Texas Instruments
- Mike Stein
- 1.0

## Library data of the parts
C1-C3 C5-C8 C101-C103 C105 C107 C108 C110-C125 = rcl:C-EU: CAPACITOR, European symbol
C4 C104 C106 C109 = rcl:CPOL-EU: POLARIZED CAPACITOR, European symbol
CLCD = MSP430_CapResistor:CAP
D101 D102 = MSP430G6_LP:BAS40-05W
ESI1 = jumper:JP8Q: JUMPER
IC101 = roy:TLV70033DSE: 200-mA, Low-I Q , Low-Dropout Regulator for Portable Devices
IC102 = eZFET:TPD4E004
IC103 = roy:TS5A21366RSER: 0.75-Ω DUAL SPST ANALOG SWITCH WITH 1.8-V COMPATIBLE INPUT LOGIC
J1 = circuitco-eagle:HEADER1X10
J2 = circuitco-eagle:HEADER1X10-J2
J3 = circuitco-eagle:HEADER1X10-J3
J4 = circuitco-eagle:HEADER1X10-J4
J5 J6 = launchpad:PINHEADER1X3
J7 J8 = launchpad:JUMPER_2.51MM
J101 = pinhead:PINHD-2X10: PIN HEADER
J102 = MSP-EXP430G6021:EZFET_MINI-USB-: MINI USB Connector Source: http://www.hirose.co.jp/cataloge_hp/e24000019.pdf
L101 = rcl:L-EU: INDUCTOR, European symbol
LCD1 = MSP430G6_LP:FH1138P
LED1 LED2 LED101 LED102 = launchpad:CHIP-LED
MSP1 = MSP-EXP430FR6989:MSP430FR6989_PZ100
MSP101 = TI_MSP430_v16:F55[0/1/2]X---RGC64: ***F55[0/1/2]X***RGC64 Rev. 1.0 06/2010 "http://www.ti.com/lit/gpn/msp430f5529" "http://www.ti.com/lit/gpn/msp430f5509" F5513/F5514 with limited Functions on some Pins
MSP102 = TI_MSP430_v16:G2X[1/5]2---RSA16: MSP430G2X[1/5]2 MSP430G2x52, MSP430G2x12 QFN (RSA) 16 Pin Package http://focus.ti.com/docs/prod/folders/print/msp430g2452.html
Q1 = microcrystal:MS3V-T1R
Q101 = MSP430G6_LP:CSTCR4M
R1 R2 R03 R4-R15 R23 R33 R103-R109 R112 R113 R119-R128 = CapResistor:RES
R101 R102 R114-R118 = MSP430_CapResistor:RES
S1-S3 = electricalmeter:PB: OMRON SWITCH
T101 = MSP430G6_LP:DMG1013UW
T102 = MSP430G6_LP:BC850CW-115
TP101-TP109 = pinhead:PINHD-1X1: PIN HEADER
U$1 = MSP430_Silkscreen:FR6989_REARSILK_REV0_1
U$2 U$3 U$5 U$6 = MSP-EXP432:MOUNTHOLE_125MIL
U$7 = MSP-EXP432:SILK_3V3_TAG
U$8 = MSP430_Silkscreen:ESIF

## Net classes
2 Power: width 0.203 mm, drill 0.305 mm, clearance 0.152 mm to class 0, clearance 0.152 mm to class 1, clearance 0.152 mm